# Altium schematic sheet SpeedLEDs.SchDoc
size A4; Organization: Altium Limited; Address1: L3, 12a Rodborough Rd; Address2: Frenchs Forest; Address3: NSW; Address4: Australia 2086
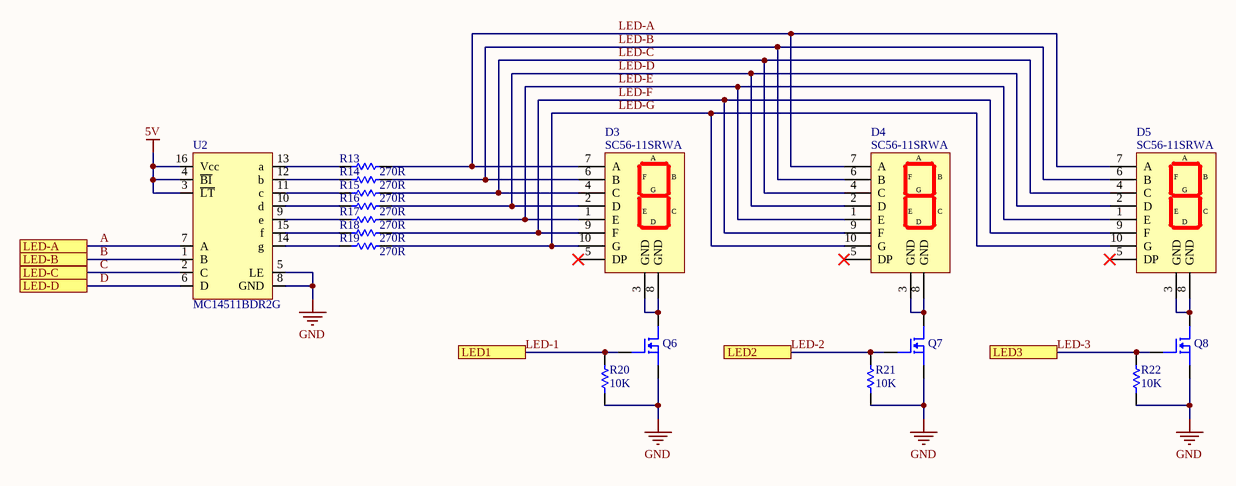
[diagram p0: SpeedLEDs.SchDoc]

## Parts
D3  SC56-11SRWA  [7-seg]
D4  SC56-11SRWA  [7-seg]
D5  SC56-11SRWA  [7-seg]
Q6  DMN6140L-13DICT-ND  [SOT-23-3]  (value not drawn)
Q7  DMN6140L-13DICT-ND  [SOT-23-3]  (value not drawn)
Q8  DMN6140L-13DICT-ND  [SOT-23-3]  (value not drawn)
R13  270R  [RES-0603]
R14  270R  [RES-0603]
R15  270R  [RES-0603]
R16  270R  [RES-0603]
R17  270R  [RES-0603]
R18  270R  [RES-0603]
R19  270R  [RES-0603]
R20  10K  [RES-0603]
R21  10K  [RES-0603]
R22  10K  [RES-0603]
U2  MC14511BDR2G  [SOIC16]

## Ports
LED1, LED2, LED3, LED-A, LED-B, LED-C, LED-D

## Nets
5V: U2.3(~{LT}) U2.4(~{BI}) U2.16(Vcc)
GND: Q6.3 Q7.3 Q8.3 R20.1 R21.1 R22.1 U2.5(LE) U2.8(GND)
A: U2.7(A) ; port LED-A
B: U2.1(B) ; port LED-B
C: U2.2(C) ; port LED-C
D: U2.6(D) ; port LED-D
LED-1: Q6.1 R20.2 ; port LED1
LED-2: Q7.1 R21.2 ; port LED2
LED-3: Q8.1 R22.2 ; port LED3
LED-A: D3.7(A) D4.7(A) D5.7(A) R13.2
LED-B: D3.6(B) D4.6(B) D5.6(B) R14.2
LED-C: D3.4(C) D4.4(C) D5.4(C) R15.2
LED-D: D3.2(D) D4.2(D) D5.2(D) R16.2
LED-E: D3.1(E) D4.1(E) D5.1(E) R17.2
LED-F: D3.9(F) D4.9(F) D5.9(F) R18.2
LED-G: D3.10(G) D4.10(G) D5.10(G) R19.2
NetD3_3: D3.3(GND) D3.8(GND) Q6.2
NetD4_3: D4.3(GND) D4.8(GND) Q7.2
NetD5_3: D5.3(GND) D5.8(GND) Q8.2
NetR13_1: R13.1 U2.13(a)
NetR14_1: R14.1 U2.12(b)
NetR15_1: R15.1 U2.11(c)
NetR16_1: R16.1 U2.10(d)
NetR17_1: R17.1 U2.9(e)
NetR18_1: R18.1 U2.15(f)
NetR19_1: R19.1 U2.14(g)

Not connected (* = marked no-connect by the designer): D3 5(DP)*; D4 5(DP)*; D5 5(DP)*

## Notes on the sheet
- Title
- Size:
- Date:
- A4
- Number:
- Time:
- Revision:
- Sheet
- of
- File:

## Library data of the parts
D3-D5 = 7-segment: DISPLAY 7SEG 0.56" SGL RED 10DIP; Manufacturer: Kingbright; Wavelength: 640nm; Luminous Intensity: 34mcd; Forward Voltage: 1.85V; Element Configuration: Common Cathode; Forward Current: 20mA; Number of Characters: 1; Max Power Dissipation: 75mW; Supplier 1: Digi-Key; Manufacturer Part Number: SC56-11SRWA; Stock 1: 32391; Pricing 1: 1=1.96, 10=1.24, 100=0.9177, 500=0.84334, 1000=0.702 (USD); Case/Package: DIP; Color: Red; Min Operating Temperature: -40°C; Max Operating Temperature: 85°C; Package Quantity: 40; Illumination Color: Red; Operating Supply Voltage: 1.85V; Packaging: Bulk; Test Current: 20mA; Display Type: Segment; Power Consumption: 75mW; Width: 0.5inch; Height: 0.75inch; RoHS Compliant: Yes; Lead Free: Lead Free; REACH SVHC: No SVHC; ComponentLink1URL: http://www.farnell.com/datasheets/2047590.pdf?src-supplier=Element14; ComponentLink1Description: http://www.farnell.com/datasheets/2047590.pdf?src-supplier=Element14; ComponentLink2URL: http://www.mouser.com/ds/2/216/SC56-11SRWA-66719.pdf?src-supplier=Mouser; ComponentLink2Description: http://www.mouser.com/ds/2/216/SC56-11SRWA-66719.pdf?src-supplier=Mouser; ComponentLink3URL: http://www.kingbrightusa.com/images/catalog/SPEC/SC56-11SRWA.pdf?src-supplier=Future+Electronics; ComponentLink3Description: http://www.kingbrightusa.com/images/catalog/SPEC/SC56-11SRWA.pdf?src-supplier=Future+Electronics; Supplier Part Number 1: 754-1467-5-ND
Q6-Q8 = N-FET-60V-1.6A: MOSFET N-CH 60V 1.6A SOT23; Manufacturer: Diodes; Rds On Max: 140mR; Input Capacitance: 315pF; Max Power Dissipation: 700mW; Supplier 1: Digi-Key; Manufacturer Part Number: DMN6140L-13; Stock 1: 274948; Pricing 1: 1=0.34, 10=0.256, 25=0.224, 100=0.1217, 250=0.12104, 500=0.09926, 1000=0.07365, 2500=0.06468, 5000=0.05924 (USD); Mount: Surface Mount; Case/Package: TO-236-3; Min Operating Temperature: -55°C; Max Operating Temperature: 150°C; Package Quantity: 10000; Packaging: Cut Tape; Drain to Source Voltage (Vdss): 60V; Continuous Drain Current (ID): 1.6A; ComponentLink1URL: https://www.diodes.com/assets/Datasheets/DMN6140L.pdf?src-supplier=Digi-Key; ComponentLink1Description: https://www.diodes.com/assets/Datasheets/DMN6140L.pdf?src-supplier=Digi-Key; Supplier Part Number 1: DMN6140L-13DIDKR-ND
R13-R19 = 0603-270R: RES SMD 270 OHM 0.5% 1/10W 0603; Manufacturer: Yageo; Manufacturer Part Number: RT0603DRE07270RL; Voltage Rating: 75V; Power Rating: 100mW; Temperature Coefficient: 50ppm/°C; Voltage Rating (DC): 50V; Supplier 1: Digi-Key; Stock 1: 5811; Pricing 1: 1=0.1, 10=0.092, 100=0.0352, 1000=0.01549, 2500=0.01338 (USD); Case/Package: 0603; Case Code (Metric): 1608; Case Code (Imperial): 0603; Min Operating Temperature: -55°C; Max Operating Temperature: 155°C; Resistance: 270R; Tolerance: 0.5%; Packaging: Tape and Reel; Package Quantity: 5000; Termination: SMD/SMT; Resistor Type: Thin Film; Number of Terminations: 2; Max Power Dissipation: 100mW; Features: Moisture Resistant; Series: RT; Length: 0.063inch; Width: 0.031inch; Height: 0.022inch; Lead Free: Lead Free; RoHS Compliant: Yes; ComponentLink1URL: http://www.yageo.com/NewPortal/yageodocoutput?fileName=/pdf/R-Chip/PYu-RT_1-to-0.05_RoHS_L_5.pdf&src-supplier=Digi-Key; ComponentLink1Description: http://www.yageo.com/NewPortal/yageodocoutput?fileName=/pdf/R-Chip/PYu-RT_1-to-0.05_RoHS_L_5.pdf&src-supplier=Digi-Key; Supplier Part Number 1: 311-2504-1-ND
R20-R22 = 0603-10KR: RES SMD 10K OHM 5% 1/10W 0603; Manufacturer: Yageo; Manufacturer Part Number: RC0603JR-0710KL; Resistance: 10kR; Voltage Rating (DC): 50V; Temperature Coefficient: 100ppm/°C; Power Rating: 100mW; Supplier 1: Digi-Key; Stock 1: 3006558; Pricing 1: 1=0.1, 10=0.019, 100=0.0077, 1000=0.00347, 2500=0.00301 (USD); Case/Package: 0603; Number of Pins: 2; Contact Plating: Tin,Matte; Case Code (Imperial): 0603; Case Code (Metric): 1608; Min Operating Temperature: -55°C; Max Operating Temperature: 155°C; Packaging: Tape and Reel; Tolerance: 5%; Composition: Thick Film; Voltage Rating: 50V; Termination: SMD/SMT; Military Standard: Not; Features: Moisture Resistant; Max Power Dissipation: 100mW; Number of Terminations: 2; Length: 0.063inch; Width: 0.031inch; Depth: 0.8mm; Height - Seated (Max): 0.022inch; Radiation Hardening: No; REACH SVHC: Unknown; Lead Free: Lead Free; ComponentLink1URL: http://www.yageo.com/documents/recent/PYu-RC_Group_51_RoHS_L_10.pdf?src-supplier=Digi-Key; ComponentLink1Description: http://www.yageo.com/documents/recent/PYu-RC_Group_51_RoHS_L_10.pdf?src-supplier=Digi-Key; Supplier Part Number 1: 311-10KGRDKR-ND
U2 = MC14511BDR2G: IC DRVR 7 SEGMENT 16SOIC; Manufacturer: ON Semiconductor; Number of Elements: 1; Propagation Delay: 1440ns; Max Supply Voltage: 18V; Min Supply Voltage: 3V; Number of Inputs: 4; Number of Outputs: 7; Operating Supply Current: 10uA; Logic Function: Decoder,Latch; Polarity: Non-Inverting; High Level Output Current: -25mA; Low Level Output Current: 4.2mA; Quiescent Current: 20uA; Display Type: LCD; Supplier 1: Digi-Key; Manufacturer Part Number: MC14511BDR2G; Stock 1: 82; Pricing 1: 1=0.63, 10=0.555, 25=0.5216, 100=0.4256, 250=0.39532, 500=0.33644, 1000=0.27772 (USD); Mount: Surface Mount; Case/Package: SOIC; Number of Pins: 16; Min Operating Temperature: -55°C; Max Operating Temperature: 125°C; Packaging: Tape and Reel; Package Quantity: 2500; Number of Bits: 4; Number of Input Lines: 4; Number of Output Lines: 7; Turn-On Delay Time: 1440ns; Series: -; Technology: CMOS; Radiation Hardening: No; Lead Free: Lead Free; Halogen Free: Halogen Free; RoHS Compliant: Yes; ComponentLink1URL: https://www.verical.com/server-webapp/html/getDatasheet?partID=319336&src-supplier=Verical; ComponentLink1Description: https://www.verical.com/server-webapp/html/getDatasheet?partID=319336&src-supplier=Verical; ComponentLink2URL: http://www.onsemi.com/pub_link/Collateral/MC14511B-D.PDF?src-supplier=Digi-Key; ComponentLink2Description: http://www.onsemi.com/pub_link/Collateral/MC14511B-D.PDF?src-supplier=Digi-Key; Supplier Part Number 1: MC14511BDR2GOSDKR-ND